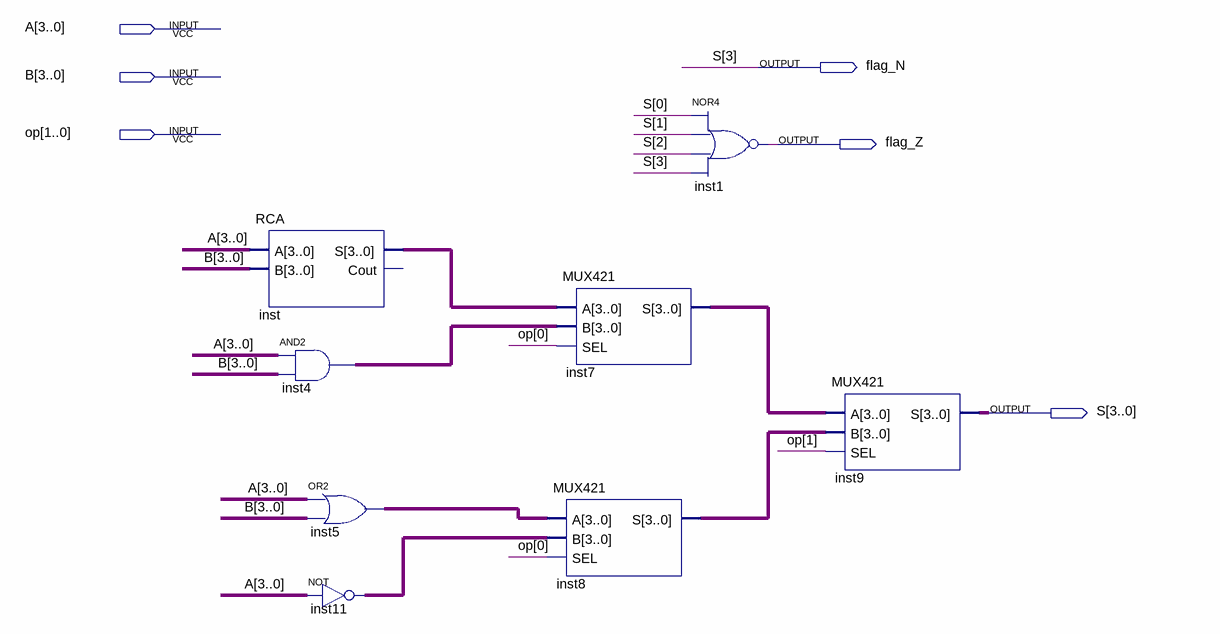
[diagram p0: schematic sheet]
// Quartus schematic LAB03.bdf as structural Verilog: 8 symbols, 6 pins
module LAB03 (
  input  [3:0] A,
  input  [3:0] B,
  input  [1:0] op,
  output flag_N,
  output flag_Z,
  output [3:0] S
);

  wire [3:0] inst4_out, inst5_out, inst7_s, inst8_s, inst11_out, inst_s;

  RCA inst (.A(A), .B(B), .S(inst_s));  // open: Cout
  assign inst4_out = A & B;  // AND2 inst4, 4 bits wide
  assign inst5_out = A | B;  // OR2 inst5, 4 bits wide
  assign inst11_out = ~A;  // NOT inst11, 4 bits wide
  MUX421 inst7 (.A(inst_s), .B(inst4_out), .SEL(op[0]), .S(inst7_s));
  MUX421 inst8 (.A(inst5_out), .B(inst11_out), .SEL(op[0]), .S(inst8_s));
  nor inst1 (flag_Z, S[0], S[1], S[2], flag_N);
  MUX421 inst9 (.A(inst7_s), .B(inst8_s), .SEL(op[1]), .S({flag_N, S[2:0]}));

  assign S[3] = flag_N;
endmodule
